# EAGLE design chaves (EAGLE 7.6.0)

## Sheet 1 of 2
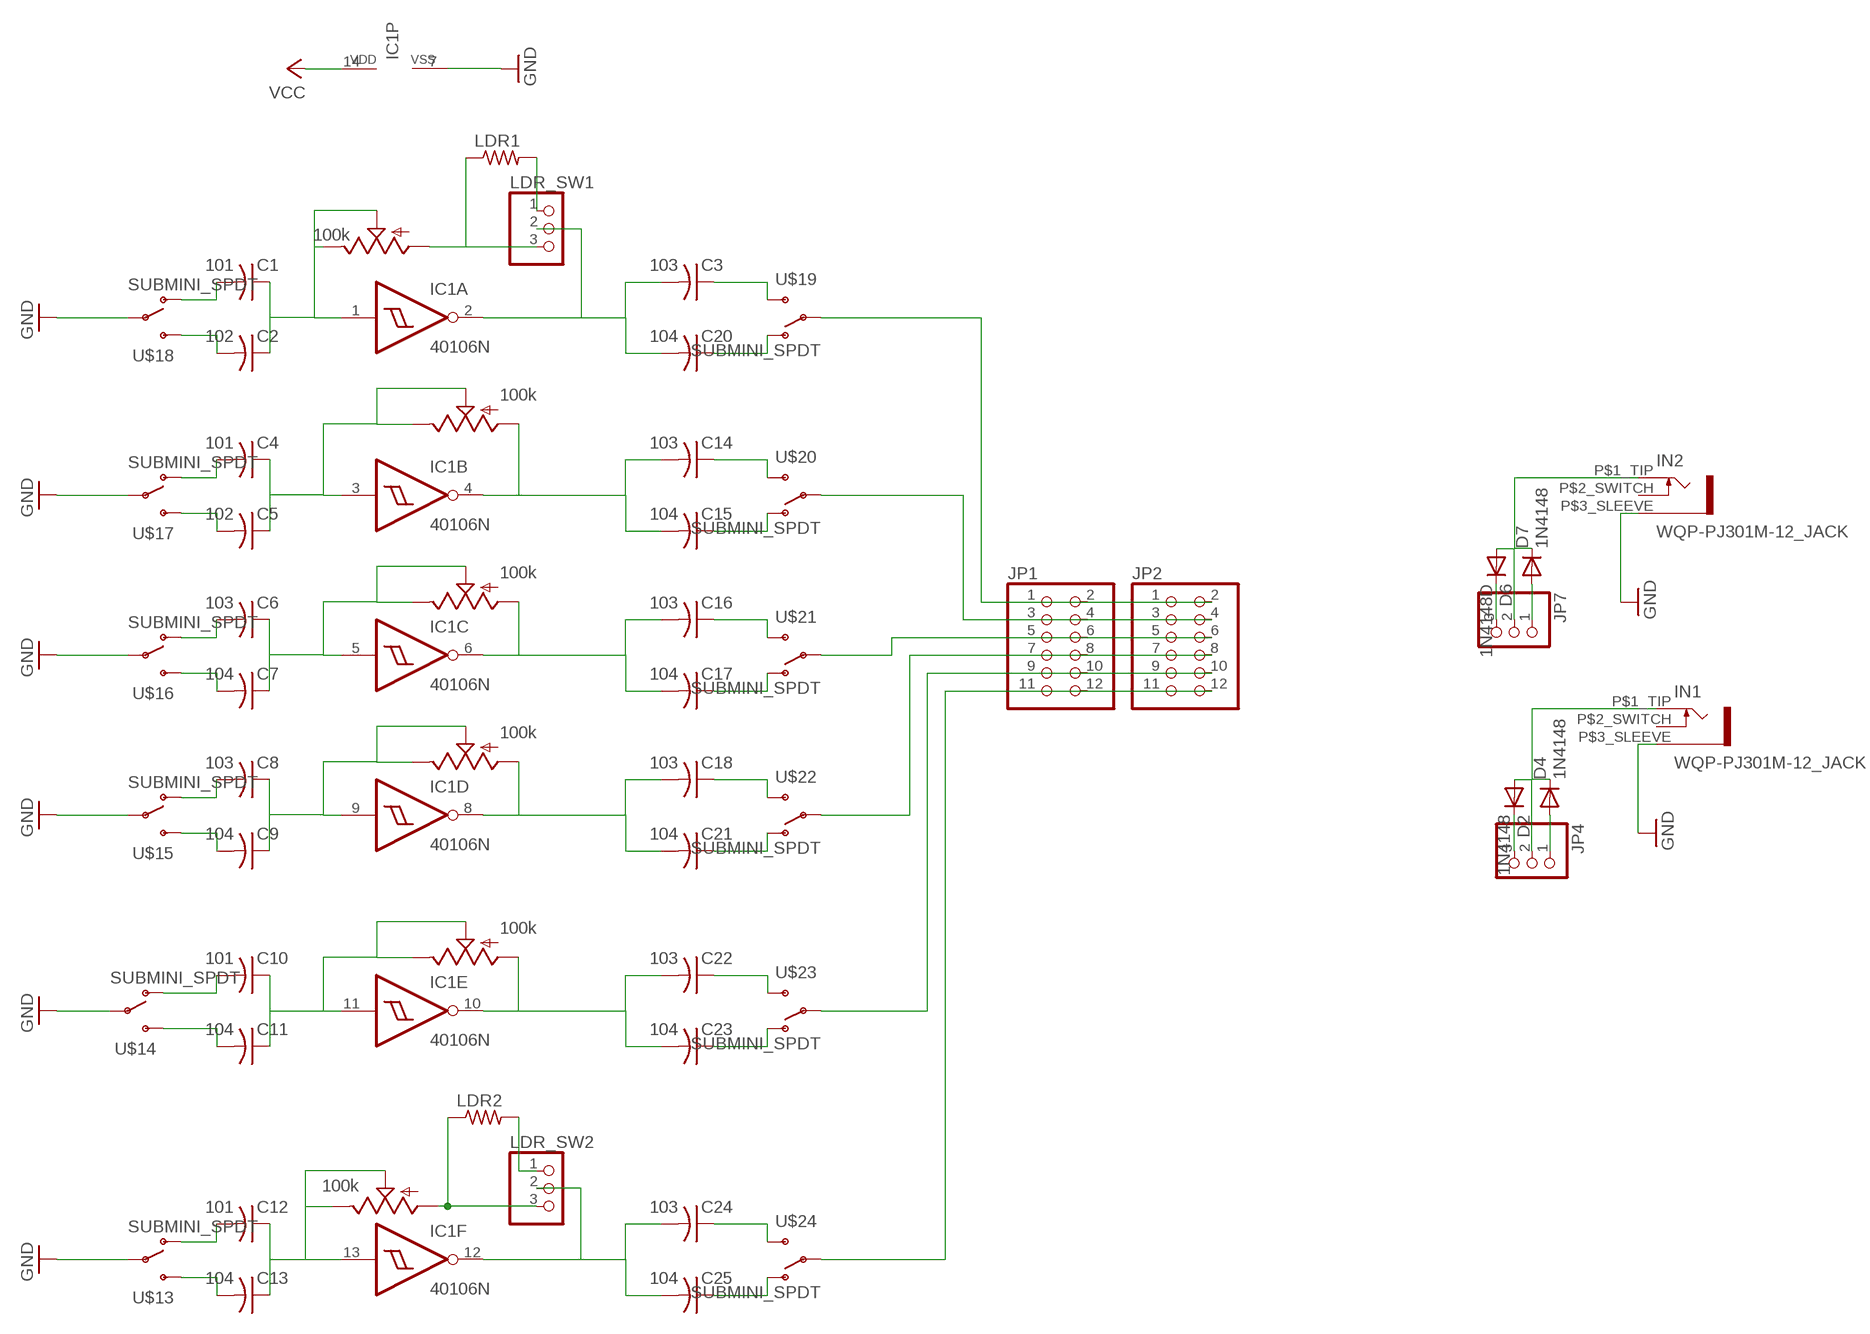
[diagram p0: schematic, sheet 1]

### Parts
C1  101  C-US050-025X075  [C050-025X075]
C2  102  C-US050-025X075  [C050-025X075]
C3  103  C-US050-025X075  [C050-025X075]
C4  101  C-US050-025X075  [C050-025X075]
C5  102  C-US050-025X075  [C050-025X075]
C6  103  C-US050-025X075  [C050-025X075]
C7  104  C-US050-025X075  [C050-025X075]
C8  103  C-US050-025X075  [C050-025X075]
C9  104  C-US050-025X075  [C050-025X075]
C10  101  C-US050-025X075  [C050-025X075]
C11  104  C-US050-025X075  [C050-025X075]
C12  101  C-US050-025X075  [C050-025X075]
C13  104  C-US050-025X075  [C050-025X075]
C14  103  C-US050-025X075  [C050-025X075]
C15  104  C-US050-025X075  [C050-025X075]
C16  103  C-US050-025X075  [C050-025X075]
C17  104  C-US050-025X075  [C050-025X075]
C18  103  C-US050-025X075  [C050-025X075]
C20  104  C-US050-025X075  [C050-025X075]
C21  104  C-US050-025X075  [C050-025X075]
C22  103  C-US050-025X075  [C050-025X075]
C23  104  C-US050-025X075  [C050-025X075]
C24  103  C-US050-025X075  [C050-025X075]
C25  104  C-US050-025X075  [C050-025X075]
D2  1N4148  1N4148DO35-7  [DO35-7]
D4  1N4148  1N4148DO35-7  [DO35-7]
D6  1N4148D  1N4148DO35-7  [DO35-7]
D7  1N4148  1N4148DO35-7  [DO35-7]
IC1  40106N  [DIL14]
IN1  WQP-PJ301M-12_JACK  [WQP-PJ301M-12_JACK]
IN2  WQP-PJ301M-12_JACK  [WQP-PJ301M-12_JACK]
JP1  PINHD-2X6  [2X06]
JP2  PINHD-2X6  [2X06]
JP4  PINHD-1X3CB  [1X03-CLEANBIG]
JP7  PINHD-1X3CB  [1X03-CLEANBIG]
LDR1  R-US_0204/7  [0204/7]
LDR2  R-US_0204/7  [0204/7]
LDR_SW1  PINHD-1X3  [1X03]
LDR_SW2  PINHD-1X3  [1X03]
POT1  100k  POT_USVERTICAL  [ALPS_POT_VERTICAL]
POT2  100k  POT_USVERTICAL  [ALPS_POT_VERTICAL]
POT3  100k  POT_USVERTICAL  [ALPS_POT_VERTICAL]
POT4  100k  POT_USVERTICAL  [ALPS_POT_VERTICAL]
POT5  100k  POT_USVERTICAL  [ALPS_POT_VERTICAL]
POT6  100k  POT_USVERTICAL  [ALPS_POT_VERTICAL]
U$13  SUBMINI_SPDT  [SUBMINI_TOGGLE]
U$14  SUBMINI_SPDT  [SUBMINI_TOGGLE]
U$15  SUBMINI_SPDT  [SUBMINI_TOGGLE]
U$16  SUBMINI_SPDT  [SUBMINI_TOGGLE]
U$17  SUBMINI_SPDT  [SUBMINI_TOGGLE]
U$18  SUBMINI_SPDT  [SUBMINI_TOGGLE]
U$19  SUBMINI_SPDT  [SUBMINI_TOGGLE]
U$20  SUBMINI_SPDT  [SUBMINI_TOGGLE]
U$21  SUBMINI_SPDT  [SUBMINI_TOGGLE]
U$22  SUBMINI_SPDT  [SUBMINI_TOGGLE]
U$23  SUBMINI_SPDT  [SUBMINI_TOGGLE]
U$24  SUBMINI_SPDT  [SUBMINI_TOGGLE]

### Nets
GND: IC1.7(P:VSS) IN1.P$3_SLEEVE IN2.P$3_SLEEVE U$13.COM(COMMON) U$14.COM(COMMON) U$15.COM(COMMON) U$16.COM(COMMON) U$17.COM(COMMON) U$18.COM(COMMON) ; also sheet 2
GND1: C3.2 C20.2 IC1.2(A:O) LDR_SW1.2
GND2: C14.2 C15.2 IC1.4(B:O) POT2.P$3(A)
GND3: C16.2 C17.2 IC1.6(C:O) POT3.P$3(A)
GND4: C18.2 C21.2 IC1.8(D:O) POT4.P$3(A)
GND5: C22.2 C23.2 IC1.10(E:O) POT5.P$3(A)
GND6: C24.2 C25.2 IC1.12(F:O) LDR_SW2.2
N$1: C1.2 U$18.1(O)
N$2: C2.2 U$18.3(S)
N$3: LDR2.2 LDR_SW2.1
N$4: C5.2 U$17.3(S)
N$5: C4.2 U$17.1(O)
N$6: LDR1.2 LDR_SW1.1
N$7: C8.2 U$15.1(O)
N$8: C9.2 U$15.3(S)
N$9: D6.A D7.C IN2.P$1_TIP JP7.2
N$10: C6.2 U$16.1(O)
N$11: C7.2 U$16.3(S)
N$16: C20.1 U$19.1(O)
N$17: C3.1 U$19.3(S)
N$18: JP1.1 JP1.2 JP2.1 JP2.2 U$19.COM(COMMON)
N$19: LDR1.1 LDR_SW1.3 POT1.P$3(A)
N$22: LDR2.1 LDR_SW2.3 POT6.P$3(A)
N$23: D2.A D4.C IN1.P$1_TIP JP4.2
N$24: C15.1 U$20.1(O)
N$26: C14.1 U$20.3(S)
N$27: JP1.3 JP1.4 JP2.3 JP2.4 U$20.COM(COMMON)
N$28: C17.1 U$21.1(O)
N$29: C16.1 U$21.3(S)
N$30: JP1.5 JP1.6 JP2.5 JP2.6 U$21.COM(COMMON)
N$31: C1.1 C2.1 IC1.1(A:I) POT1.P$1(E) POT1.P$2(S)
N$32: C4.1 C5.1 IC1.3(B:I) POT2.P$1(E) POT2.P$2(S)
N$33: C6.1 C7.1 IC1.5(C:I) POT3.P$1(E) POT3.P$2(S)
N$34: C8.1 C9.1 IC1.9(D:I) POT4.P$1(E) POT4.P$2(S)
N$37: C21.1 U$22.1(O)
N$38: C18.1 U$22.3(S)
N$39: JP1.7 JP1.8 JP2.7 JP2.8 U$22.COM(COMMON)
N$40: C23.1 U$23.1(O)
N$41: C22.1 U$23.3(S)
N$42: JP1.9 JP1.10 JP2.9 JP2.10 U$23.COM(COMMON)
N$43: C25.1 U$24.1(O)
N$44: C24.1 U$24.3(S)
N$45: JP1.11 JP1.12 JP2.11 JP2.12 U$24.COM(COMMON)
N$46: C10.2 U$14.1(O)
N$47: C10.1 C11.1 IC1.11(E:I) POT5.P$1(E) POT5.P$2(S)
N$48: C11.2 U$14.3(S)
N$49: C13.2 U$13.3(S)
N$50: C12.2 U$13.1(O)
N$51: C12.1 C13.1 IC1.13(F:I) POT6.P$1(E) POT6.P$2(S)
N$52: D2.C JP4.3
N$53: D4.A JP4.1
N$56: D6.C JP7.3
N$58: D7.A JP7.1
VCC: IC1.14(P:VDD) ; also sheet 2
Unconnected: IN1.P$2_SWITCH IN2.P$2_SWITCH

## Sheet 2 of 2
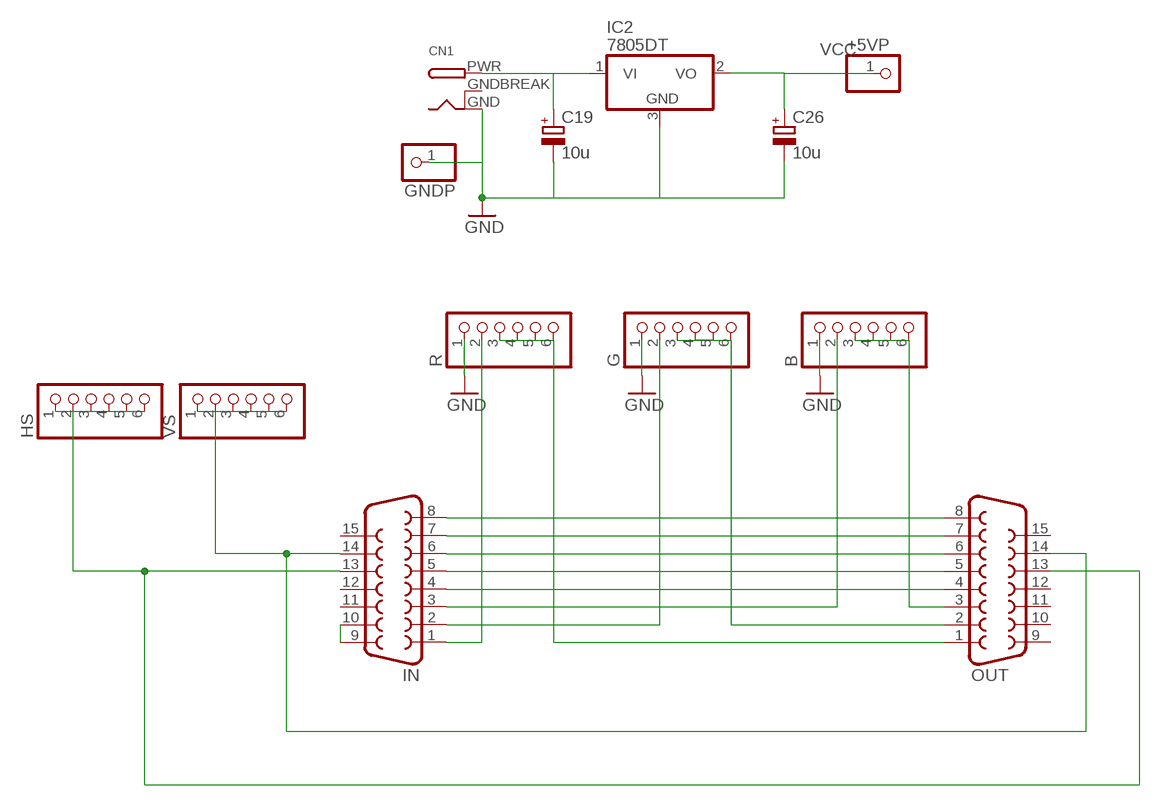
[diagram p1: schematic, sheet 2]

### Parts
+5VP  PINHD-1X1CB  [1X01-CLEANBIG]
B  PINHD-1X6CLEAN  [1X06-CLEAN]
C19  10u  CPOL-EUE2.5-5  [E2,5-5]
C26  10u  CPOL-EUE2.5-5  [E2,5-5]
CN1  DCBARRELPTH  [DCJACK_2MM_PTH]
G  PINHD-1X6CLEAN  [1X06-CLEAN]
GNDP  PINHD-1X1CB  [1X01-CLEANBIG]
HS  PINHD-1X6CLEAN  [1X06-CLEAN]
IC2  7805DT  [TO252]
IN  F15HDH  [HDF15H]
OUT  F15HDH  [HDF15H]
R  PINHD-1X6CLEAN  [1X06-CLEAN]
VS  PINHD-1X6CLEAN  [1X06-CLEAN]

### Nets
GND: B.1 C19.- C26.- CN1.GND G.1 GNDP.1 IC2.3(GND) IN.4 IN.5 IN.6 IN.7 IN.8 IN.9 IN.10 OUT.4 OUT.5 OUT.6 OUT.7 OUT.8 R.1 ; also sheet 1
N$12: IN.1 R.2
N$14: OUT.1 R.3 R.4 R.5 R.6
N$15: G.2 IN.2
N$21: G.3 G.4 G.5 G.6 OUT.2
N$25: B.2 IN.3
N$36: B.3 B.4 B.5 B.6 OUT.3
N$54: IN.14 OUT.14 VS.1 VS.2 VS.3 VS.4 VS.5 VS.6
N$55: HS.1 HS.2 HS.3 HS.4 HS.5 HS.6 IN.13 OUT.13
N$57: C19.+ CN1.PWR IC2.1(VI)
VCC: +5VP.1 C26.+ IC2.2(VO) ; also sheet 1
Unconnected: IN.11 IN.12 IN.15 OUT.9 OUT.10 OUT.11 OUT.12 OUT.15

## Power pins joined to a net without a drawn wire
GNDBREAK: CN1.GNDBREAK

## Library data of the parts
+5VP GNDP = adafruit:PINHD-1X1: Pin header 1x1 for 0.1" spacing With round pins
B G HS R VS = adafruit:PINHD-1X6: PIN HEADER
C1-C18 C20-C25 = adafruit:C-US: CAPACITOR, American symbol
C19 C26 = rcl:CPOL-EU: POLARIZED CAPACITOR, European symbol
CN1 = adafruit:DCBARREL: 2.0mm DC Barrel Jack DCJACK_2MM_PTH - Through Hole Jack (4UConnector: 05537)
D2 D4 D6 D7 = diode:1N4148: DIODE high speed (Philips)
IC1 = 40xx:40106: Hex SCHMITT TRIGGER
IC2 = adafruit:78*: Positive VOLTAGE REGULATOR Added bigger pads to the TO-92 package
IN OUT = adafruit:F15: SUB-D HDH is also known as a 'right angle VGA' connector
IN1 IN2 = MusicThingModular:WQP-PJ301M-12_JACK
JP1 JP2 = pinhead:PINHD-2X6: PIN HEADER
JP4 JP7 = adafruit:PINHD-1X3: PIN HEADER
LDR1 LDR2 = adafruit:R-US_: RESISTOR, American symbol
LDR_SW1 LDR_SW2 = pinhead:PINHD-1X3: PIN HEADER
POT1-POT6 = pot-alps:POT_US
U$13-U$24 = MusicThingModular:SUBMINI_SPDT

## Net classes
0 default: width 0.406 mm, drill 0.254 mm, clearance 0.254 mm

## Board
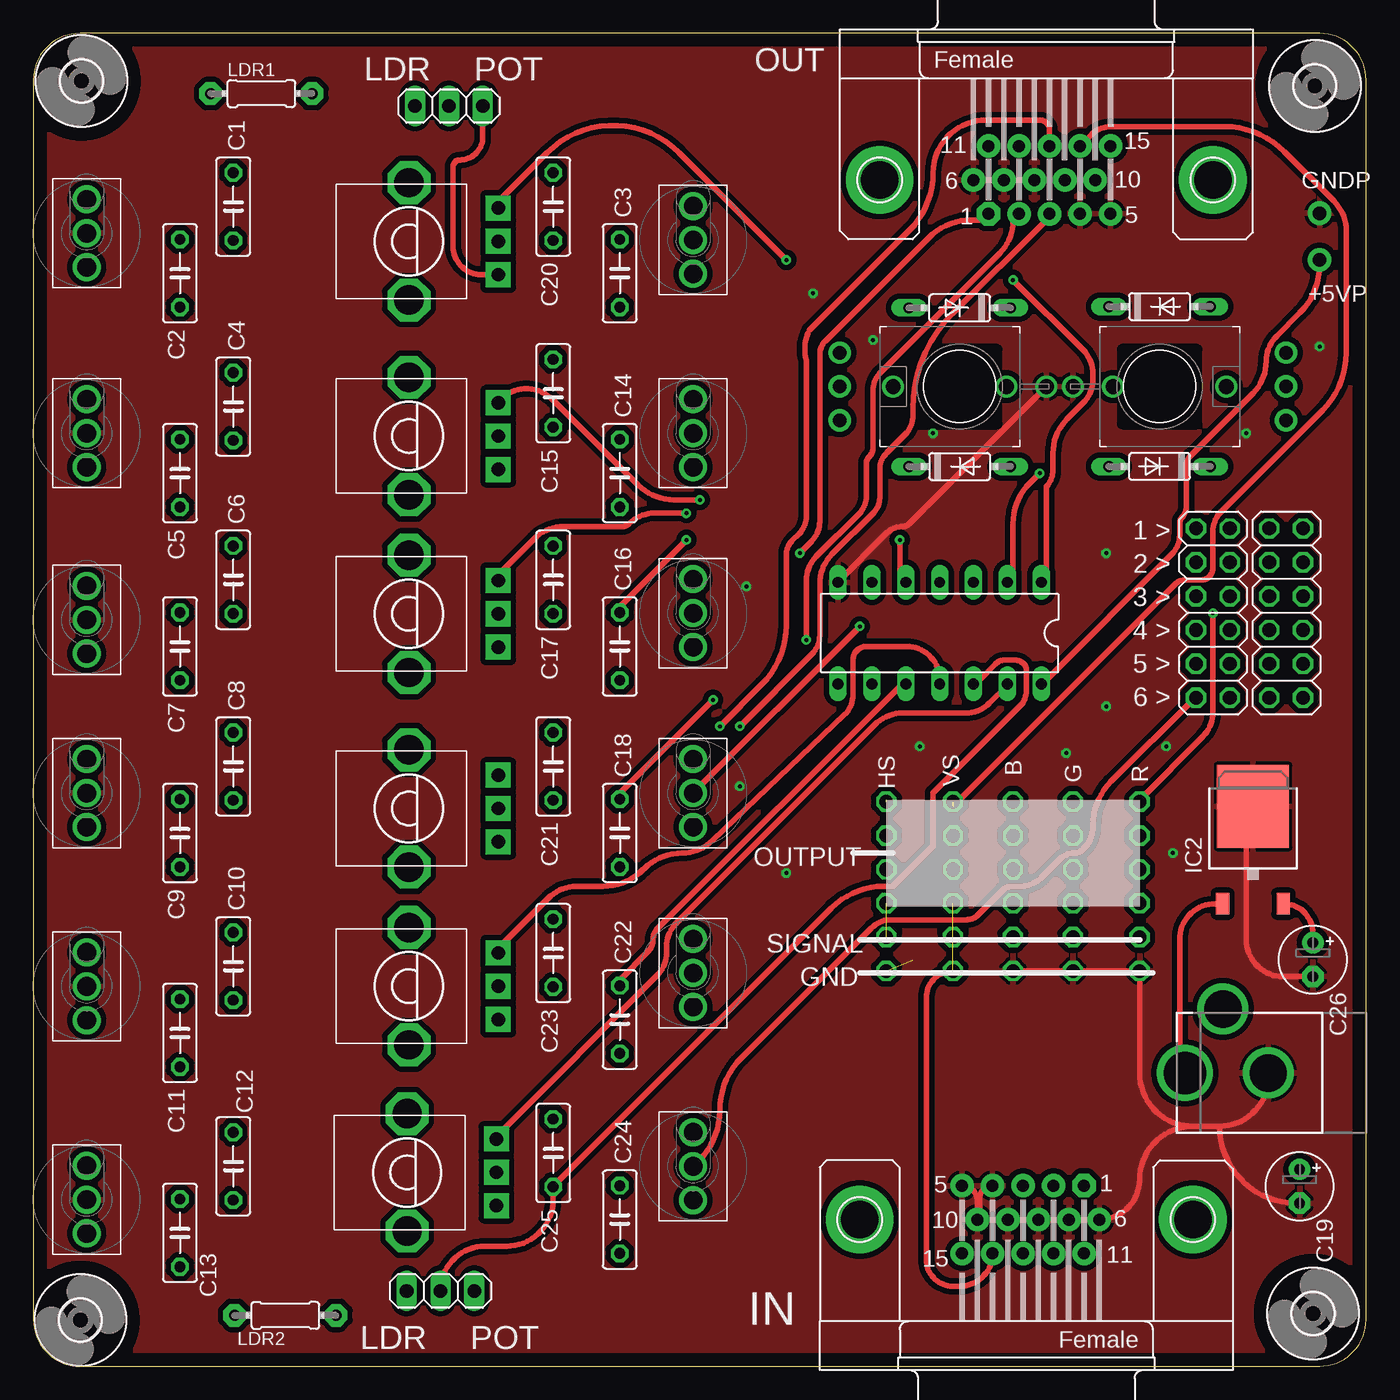
[diagram p2: board, top side]
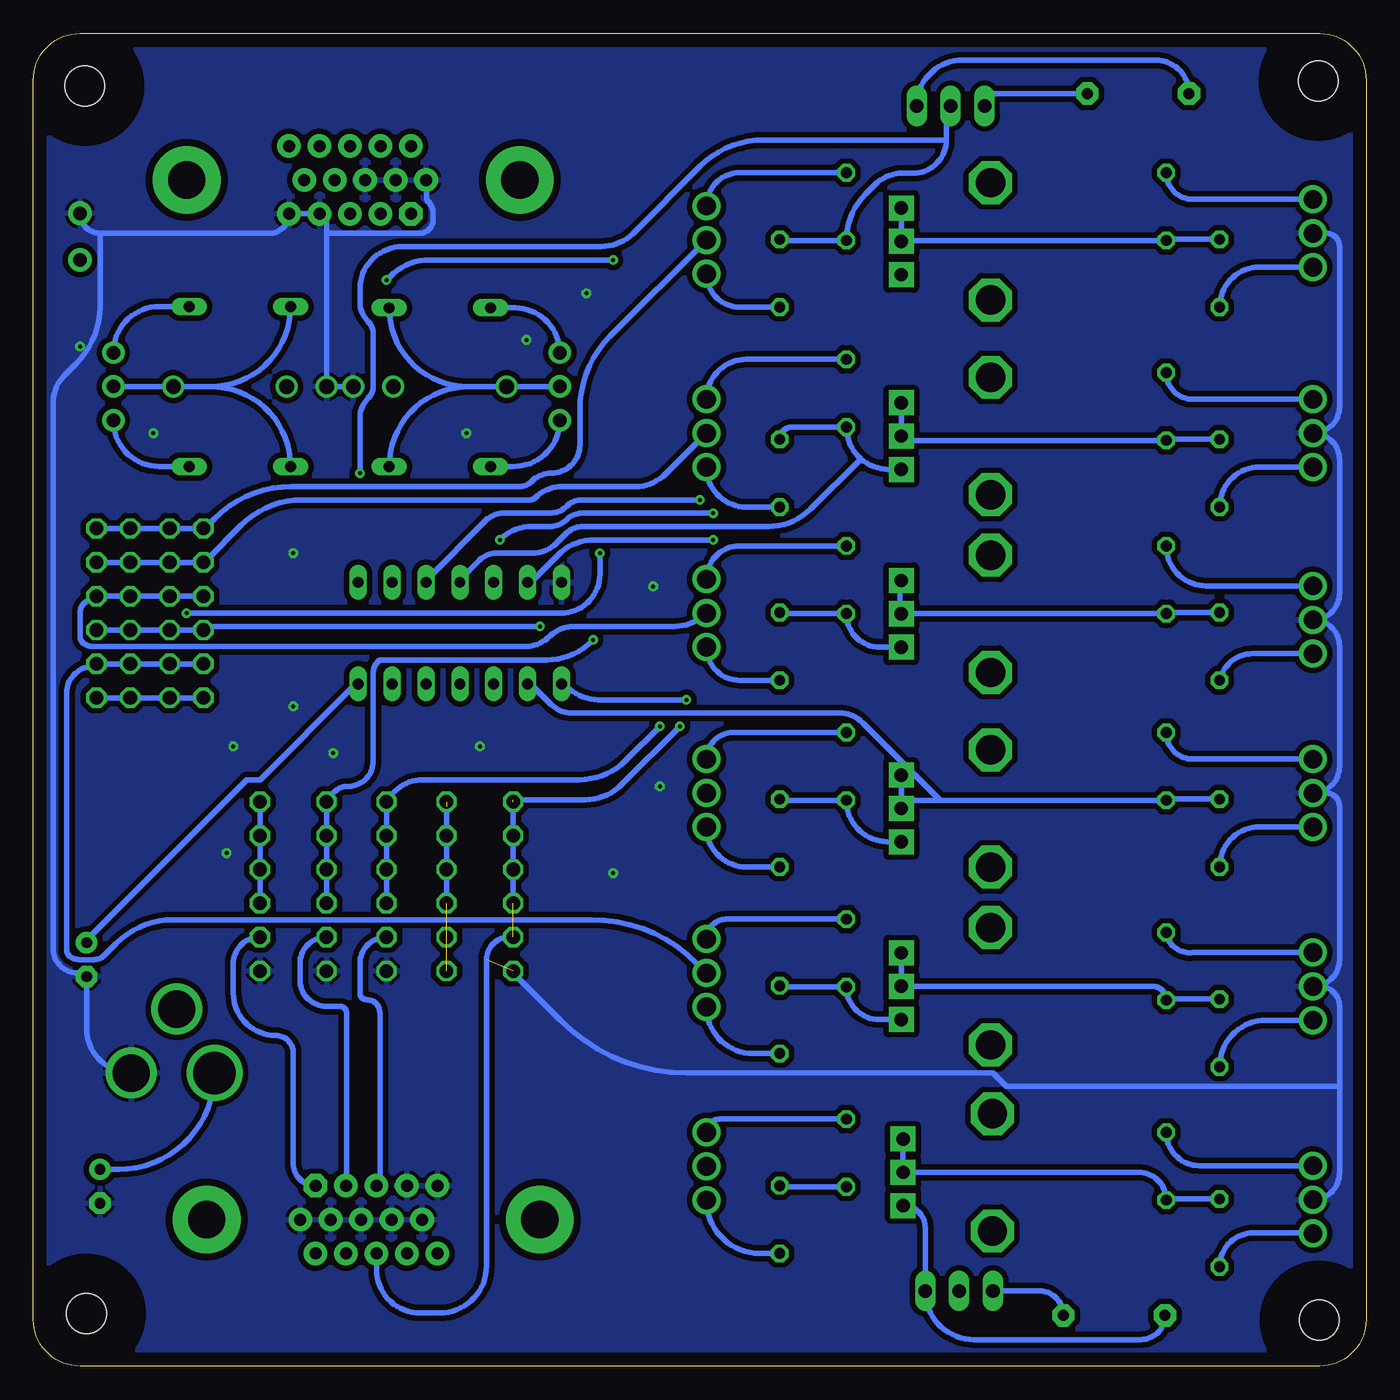
[diagram p3: board, bottom side, seen from below]

Size 100 x 100 mm. Coordinates in mm from the lower left corner, seen from the top.
Outline: 0,96.5 0,3.5 arc90 3.5,0 96.5,0 arc90 100,3.5 100,96.5 arc90 96.5,100 3.5,100 arc90 0,96.5
Copper layers (1*16): Top 0.035mm / dielectric 1.5mm / Bottom 0.035mm
Design rules "default *": minimum track width 10mil, minimum drill 24mil, track to track 8mil, track to pad 8mil, pad to pad 8mil, via to via 8mil, smd to smd 8mil, copper to edge 40mil, drill to drill 8mil, minimum pad ring 10mil, minimum via ring 8mil, stop-mask expansion 4mil, vias tented up to drill 0.33mm, thermal gap 10mil

### Footprints (pad centres in the part's own frame; a part is rotated, then mirrored left to right if it is on the bottom)
1X01-CLEANBIG = drill 1.016 pad 1.778: 1 0,0
1X06-CLEAN = drill 1.016 octagon: 1 -6.35,0; 2 -3.81,0; 3 -1.27,0; 4 1.27,0; 5 3.81,0; 6 6.35,0
C050-025X075 = drill 0.813 octagon: 1 -2.54,0; 2 2.54,0
E2,5-5 = drill 0.813 pad 1.6: + -1.27,0 | drill 0.813 pad 1.6 octagon: - 1.27,0
DCJACK_2MM_PTH = drill 2.8: GND 0,7.35; GNDBREAK 4.8,10.75 | drill 3.2: PWR 0,13.6
DO35-7 = drill 0.813 long: A 3.81,0; C -3.81,0
3,0 = hole 3: 0,0
DIL14 = drill 0.813 long: 1 -7.62,-3.81; 2 -5.08,-3.81; 3 -2.54,-3.81; 4 0,-3.81; 5 2.54,-3.81; 6 5.08,-3.81; 7 7.62,-3.81; 8 7.62,3.81; 9 5.08,3.81; 10 2.54,3.81; 11 0,3.81; 12 -2.54,3.81; 13 -5.08,3.81; 14 -7.62,3.81
TO252 = smd 1 x 1.6: 1 -2.28,-4.8; 2 2.28,-4.8 | smd 5.4 x 6.2: 3 0,2.5
HDF15H = drill 0.9 pad 1.778 octagon: 1 4.329,2.54 | drill 0.9 pad 1.778: 2 2.043,2.54; 3 -0.243,2.54; 4 -2.529,2.54; 5 -4.815,2.54; 6 5.472,0; 7 3.186,0; 8 0.9,0; 9 -1.386,0; 10 -3.672,0; 11 4.329,-2.54; 12 2.043,-2.54; 13 -0.243,-2.54; 14 -2.529,-2.54; 15 -4.815,-2.54 | drill 2.8 pad 5.08: P$1 -12.5,0; P$2 12.5,0
WQP-PJ301M-12_JACK = drill 1.1: P$1_TIP 0,5; P$2_SWITCH 0,-3.5; P$3_SLEEVE 0,-6.5
2X06 = drill 1.016 octagon: 1 -6.35,-1.27; 2 -6.35,1.27; 3 -3.81,-1.27; 4 -3.81,1.27; 5 -1.27,-1.27; 6 -1.27,1.27; 7 1.27,-1.27; 8 1.27,1.27; 9 3.81,-1.27; 10 3.81,1.27; 11 6.35,-1.27; 12 6.35,1.27
1X03-CLEANBIG = drill 1.016 pad 1.676: 1 -2.54,0; 2 0,0; 3 2.54,0
0204/7 = drill 0.813 pad 1.676 octagon: 1 -3.81,0; 2 3.81,0
1X03 = drill 1.016 long: 1 -2.54,0; 2 0,0; 3 2.54,0
ALPS_POT_VERTICAL = drill 1 pad 1.88 square: P$1 -2.5,6.7; P$2 0,6.7; P$3 2.5,6.7 | drill 2.2 pad 3.175 octagon: P$4 -4.4,0; P$5 4.4,0
SUBMINI_TOGGLE = drill 1.4 pad 1.829: 1 -2.54,0; 3 2.54,0; COM 0,0

### Placement (x,y rotation side)
+5VP  96.5,83 0 top
B  73.5,36 90 top
C1  15,87 90 top
C2  11,82 270 top
C3  44,82 90 top
C4  15,72 90 top
C5  11,67 270 top
C6  15,59 90 top
C7  11,54 270 top
C8  15,45 90 top
C9  11,40 270 top
C10  15,30 90 top
C11  11,25 270 top
C12  15,15 90 top
C13  11,10 270 top
C14  44,67 90 top
C15  39,73 270 top
C16  44,54 90 top
C17  39,59 270 top
C18  44,40 90 top
C19  95,13.5 270 top
C20  39,87 270 top
C21  39,45 270 top
C22  44,26 90 top
C23  39,31 270 top
C24  44,11 90 top
C25  39,16 270 top
C26  96,30.5 270 top
CN1  100,22 90 top
D2  84.5,67.5 180 top
D4  84.5,79.5 0 top
D6  69.5,67.5 0 top
D7  69.5,79.4 180 top
E$1  [3,0]  96.02,3.95 0 top
E$5  [3,0]  3.52,3.45 0 top
E$7  [3,0]  3.6,96.42 0 top
E$8  [3,0]  96.15,96.06 0 top
G  78,36 90 top
GNDP  96.5,86.5 0 top
HS  64,36 90 top
IC1  68,55 180 top
IC2  91.5,39.5 0 top
IN  74.5,11 0 top
IN1  84.5,73.5 270 top
IN2  69.5,73.5 90 top
JP1  88.5,56.5 270 top
JP2  94,56.5 270 top
JP4  94,73.5 270 top
JP7  60.5,73.5 270 top
LDR1  17.11,95.48 0 top
LDR2  18.91,3.81 0 top
LDR_SW1  31.18,94.55 0 top
LDR_SW2  30.55,5.65 0 top
OUT  76,89 180 top
POT1  28.18,84.39 270 top
POT2  28.18,69.78 270 top
POT3  28.18,56.45 270 top
POT4  28.18,41.84 270 top
POT5  28.18,28.51 270 top
POT6  28.05,14.54 270 top
R  83,36 90 top
U$13  4,12.5 270 top
U$14  4,28.5 270 top
U$15  4,43 270 top
U$16  4,56 270 top
U$17  4,70 270 top
U$18  4,85 270 top
U$19  49.5,84.5 270 top
U$20  49.5,70 270 top
U$21  49.5,56.5 270 top
U$22  49.5,43 270 top
U$23  49.5,29.5 270 top
U$24  49.5,15 270 top
VS  69,36 90 top

### Tracks (layer width: path | path; a pad name or v marks a point on that pad's centre or on a via)
GND  (via drill 0.3)
  Top 0.406: CN1.GND 92.65,21.65 arc-90 89,18 | 89,18 87,18 | 87,18 arc-90 83,22 R.1 G.1 B.1 | IN.5 arc-90 70.83,12.4 IN.10 71,11 | 71,11 71,12.57 arc-90 IN.4 | 71,11 IN.9 IN.8 IN.7 IN.6 80,11 arc90 83,14 arc-90 87,18 | C19.- 94.77,12.23 arc-90 89,18 | C26.- 93.77,29.23 arc-90 91,32 91,41 arc-90 92,42 IC2.3 | OUT.6 OUT.7 OUT.8 | IN2.P$3_SLEEVE 65.68,63.18 arc-45 65.25,63 arc45 63.97,62.47 60.5,59 IC1.7
  Bottom 0.406: U$13.COM arc-90 2,14.5 2,21 | 2,21 2,27 arc-90 3.5,28.5 U$14.COM arc-90 2,30.5 2,42 arc-90 3,43 U$15.COM arc-90 2,45 2,54 arc-90 U$16.COM arc-90 2,58 2,68 arc-90 U$17.COM arc-90 2,72 2,84 arc-90 3,85 U$18.COM | CN1.GND arc90 96,25.35 C26.- 96,29.5 96.7,29.5 arc90 98.5,31.3 98.5,72.33 arc45 97.67,74.33 96.77,75.23 arc-45 95,79.5 95,85 | IN2.P$3_SLEEVE IN1.P$3_SLEEVE 78,85 | 78,85 78,85.93 arc-90 OUT.4 OUT.5 arc90 82.28,85 95,85 | 95,85 arc90 GNDP.1 | 78,85 71,85 arc-90 70,86 70,86.5 arc-45 70.35,87.35 arc45 70.5,87.71 70.5,89 OUT.6 | 2,21 27,21 28,22 50.94,22 arc45 60.44,25.93 64,29.5
  other vias: 56.5,37 53,43.5 58.5,80.5 66.5,46.5 85,46.5 63,77 91,70 80.5,49.5 96.5,76.5 53.5,58.5 80.5,61 77.5,46 85.5,38.5 67.5,70
  pour Top (isolate 0.406): 0,100 100,100 100,0 0,0
  pour Bottom (isolate 0.406): 0,100 100,100 100,0 0,0
GND1  (via drill 0.3)
  Top 0.406: v75.5,67 74.75,66.25 arc45 73.5,63.23 73.5,59 IC1.2
  Bottom 0.406: C3.2 arc-90 43.92,84.46 C20.2 arc45 37.56,87.94 36.85,88.65 arc45 34.79,89.5 34,89.5 arc-90 31.5,92 | LDR_SW1.2 arc-90 31.5,94.23 31.5,92 | v75.5,67 75.5,71.12 arc45 74.88,72.62 arc-45 74.5,73.54 74.5,77.46 arc-45 74.88,78.38 arc45 75.5,79.88 75.5,80.8 arc90 72.3,84 57.39,84 arc-45 55.02,84.98 49.97,90.03 arc45 45.21,92 31.5,92
GND2
  Bottom 0.406: C14.2 arc90 43.08,70.46 C15.2 arc-49 37.93,68.08 | POT2.P$3 35.83,67.28 arc41 37.93,68.08 | IC1.4 68,59 66.53,60.47 arc45 65.25,61 62.54,61 arc-45 60.77,61.73 60.03,62.47 arc45 58.75,63 44.85,63 arc-45 41.69,64.31 38,68 37.93,68.08
GND3  (via drill 0.3)
  Top 0.406: v49,62 44,57 C16.2
  Bottom 0.406: POT3.P$3 36.49,53.95 arc90 C17.2 43.92,56.46 arc90 C16.2 | v49,62 57.88,62 arc-45 60.64,60.86 62.5,59 IC1.6
GND4  (via drill 0.3)
  Top 0.406: v51,50 44,43 C18.2
  Bottom 0.406: POT4.P$3 35.88,39.34 arc90 C21.2 43.92,42.46 arc90 C18.2 | v51,50 57.59,50 arc45 60,51 IC1.8
GND5
  Top 0.406: IC1.10 65,51 46.83,32.83 arc45 46.5,32.04 arc-45 46.12,31.12 44,29 C22.2
  Bottom 0.406: POT5.P$3 36.55,26.01 arc90 C23.2 43.92,28.46 arc90 C22.2
GND6
  Top 0.406: LDR_SW2.2 arc-90 33.9,9 35.5,9 arc90 39,12.5 C25.2 39,13.5 59.88,34.38 arc-45 63.79,36 64.5,36 67.5,39 67.5,43 74.06,49.56 arc45 74.5,50.62 74.5,52.26 arc45 74.33,52.67 arc45 73.54,53 72.96,53 arc45 72.17,52.67 71,51.5 IC1.12
  Bottom 0.406: C25.2 43.92,13.46 arc90 C24.2
N$1
  Bottom 0.406: U$18.1 13,87.54 arc90 C1.2
N$2
  Bottom 0.406: U$18.3 8,82.46 arc-90 C2.2
N$3
  Bottom 0.406: LDR2.2 arc-90 24.55,5.65 LDR_SW2.1
N$4
  Bottom 0.406: U$17.3 8,67.46 arc-90 C5.2
N$5
  Bottom 0.406: U$17.1 13,72.54 arc90 C4.2
N$6
  Bottom 0.406: LDR1.2 27.71,95.48 arc-90 LDR_SW1.1
N$7
  Bottom 0.406: U$15.1 13,45.54 arc90 C8.2
N$8
  Bottom 0.406: U$15.3 8,40.46 arc-90 C9.2
N$9
  Bottom 0.406: JP7.2 IN2.P$1_TIP 67.31,73.5 | 67.31,73.5 67.41,73.5 arc90 D7.C | D6.A arc90 67.31,73.5
N$10
  Bottom 0.406: U$16.1 12,58.54 arc90 C6.2
N$11
  Bottom 0.406: U$16.3 8.54,53.46 arc-90 11,51 C7.2
N$12
  Bottom 0.406: R.2 arc-90 85,30.19 85,28 arc-90 81.81,24.81 arc90 80.5,23.5 80.5,15.21 arc-90 IN.1
N$14  (via drill 0.3)
  Top 0.406: v57.5,61 58.38,61.88 arc45 59,63.38 59,75.91 arc-45 59.41,76.91 67.15,84.65 arc-45 70.41,86 71.5,86 OUT.1 | v88.5,56.5 88.5,49.06 arc-45 87.75,47.25 83,42.5 R.6
  Bottom 0.406: R.6 R.5 | R.5 83,39 | R.5 R.4 R.3 | v88.5,56.5 60.41,56.5 arc-90 57.5,59.41 v57.5,61
N$15
  Bottom 0.406: G.2 arc-90 80,30.19 80,29 arc-90 78,27 77,27 arc90 76.5,26.5 76.5,13.58 arc90 IN.2
N$16
  Bottom 0.406: C20.1 47,89.54 arc-90 U$19.1
N$17
  Bottom 0.406: C3.1 47,79.46 arc90 U$19.3
N$18
  Bottom 0.406: JP2.2 JP2.1 JP1.2 JP1.1 87,63 86.4,63.6 arc45 80.6,66 63.54,66 arc-45 62.62,66.38 arc45 61.12,67 arc-90 59,69.12 59,71.78 arc45 56.72,77.28 U$19.COM
N$19
  Top 0.406: LDR_SW1.3 33.72,92.22 arc-90 32,90.5 arc90 31.5,90 31.5,84 arc90 33.61,81.89 POT1.P$3
  Bottom 0.406: LDR1.1 arc-90 15.81,98 30.27,98 arc-90 LDR_SW1.3
N$21  (via drill 0.3)
  Top 0.406: v58,54.5 58,58.96 arc-45 58.73,60.73 61.97,63.97 arc45 62.5,65.25 62.5,67.71 arc-45 62.71,68.21 arc45 63,68.91 63,73.17 arc-45 63.59,74.59 72.52,83.52 arc45 73.5,85.89 73.5,86 OUT.2
  Bottom 0.406: G.3 G.4 G.5 G.6 78,42.5 77.41,43.09 arc45 76.41,43.5 arc-90 74.5,45.41 74.5,52 arc45 74.15,52.85 arc45 73.79,53 61.45,53 arc-45 58.12,54.38 v58,54.5
N$22
  Bottom 0.406: LDR2.1 arc90 16.91,2 29.43,2 arc90 LDR_SW2.3 33.09,10.38 arc-90 POT6.P$3
N$23
  Bottom 0.406: JP4.2 IN1.P$1_TIP 86.69,73.5 | D2.A arc-90 86.69,73.5 | D4.C arc90 86.69,73.5
N$24
  Bottom 0.406: C15.1 46.5,75.54 arc-90 U$20.1
N$25
  Bottom 0.406: B.2 arc-90 75.5,30.19 75.5,28 arc-90 75,27.5 arc90 74,26.5 74,13.8 arc90 IN.3
N$26
  Bottom 0.406: C14.1 46.5,64.46 arc90 U$20.3
N$27
  Bottom 0.406: JP2.4 JP2.3 JP1.4 JP1.3 87,60.5 84.41,63.09 arc45 79.8,65 62.71,65 arc-45 62.35,65.15 arc45 60.29,66 54.83,66 arc-45 52.56,66.94 U$20.COM
N$28
  Bottom 0.406: C17.1 47,61.54 arc-90 U$21.1
N$29
  Bottom 0.406: C16.1 47,51.46 arc90 U$21.3
N$30
  Bottom 0.406: JP1.5 JP1.6 JP2.5 JP2.6 95.5,57.5 arc-90 96.5,56.5 96.5,54.79 arc-45 96.29,54.29 arc-45 95.59,54 63.09,54 arc-45 61.23,54.77 arc45 59.46,55.5 51.91,55.5 arc-45 U$21.COM
N$31  (via drill 0.3)
  Top 0.406: v73.5,81.5 78.77,76.23 arc-45 79.5,74.46 79.5,74.06 arc-45 78.75,72.25 77.56,71.06 arc45 76.5,68.51 76.5,67.21 arc-45 76,66 76,59 IC1.1 | v56.5,83 48.46,91.04 arc90 38.54,91.04 34.5,87 POT1.P$1
  Bottom 0.406: C2.1 14.92,84.54 arc-90 C1.1 34.81,84.46 arc-90 POT1.P$2 POT1.P$1 | v56.5,83 70.24,83 arc-45 73.24,81.76 v73.5,81.5
N$32  (via drill 0.3)
  Top 0.406: v50,65 48.08,65 arc-45 45.38,66.11 39,72.5 arc90 35,72.5 POT2.P$1
  Bottom 0.406: C5.1 14.92,69.54 arc-90 C4.1 34.55,69.46 arc90 POT2.P$2 POT2.P$1 | v50,65 58.83,65 arc-45 59.97,64.53 arc45 61.25,64 64.75,64 arc-45 66.03,63.47 70.5,59 IC1.3
N$33  (via drill 0.3)
  Top 0.406: v65,62 65,59 IC1.5 | v49,64 46.62,64 arc45 44.71,63.21 arc-45 44.2,63 39.83,63 arc45 37.56,62.06 34.5,59 POT3.P$1
  Bottom 0.406: C7.1 14.46,56.54 arc-90 15,56 C6.1 POT3.P$2 arc-90 POT3.P$2 34.88,56.12 arc90 35,56 35,58.83 arc90 POT3.P$1 | v65,62 arc45 62.59,63 61.25,63 arc-45 59.97,63.53 arc45 58.83,64 v49,64
N$34
  Bottom 0.406: C9.1 14.92,42.54 arc-90 C8.1 32,42.46 | 32,42.46 34.27,42.46 arc-90 POT4.P$2 POT4.P$1 | IC1.9 62.5,51 61.16,49.66 arc-45 59.57,49 39.54,49 arc45 37.77,48.27 32,42.5 32,42.46
N$36  (via drill 0.3)
  Top 0.406: v53,48 58.41,53.41 arc45 59,54.83 59,58.69 arc-45 59.93,60.93 63.06,64.06 arc45 63.5,65.12 63.5,67.25 arc-45 64.03,68.53 65.41,69.91 arc45 66,71.33 66,71.81 arc-45 68.97,78.97 76,86 OUT.3
  Bottom 0.406: B.3 B.4 B.5 B.6 73.5,42.5 72.85,43.15 arc45 70.79,44 59.05,44 arc-45 55.55,45.45 v53,48
N$37
  Bottom 0.406: C21.1 47.5,47.54 arc-90 U$22.1
N$38
  Bottom 0.406: C18.1 46.5,37.46 arc90 U$22.3
N$39  (via drill 0.3)
  Top 0.406: v62,55.5 U$22.COM
  Bottom 0.406: JP2.8 JP2.7 JP1.8 JP1.7 87,55.5 v62,55.5
N$40
  Bottom 0.406: C23.1 48,33.54 arc-90 U$23.1
N$41
  Bottom 0.406: C22.1 46,23.46 arc90 U$23.3
N$42
  Bottom 0.406: JP1.9 JP1.10 JP2.9 JP2.10 95.5,52.5 arc-90 97.5,50.5 97.5,31.24 arc-45 97.33,30.83 arc-45 96.54,30.5 95.46,30.5 arc-45 94.67,30.83 93.77,31.73 arc45 89.5,33.5 58.13,33.5 arc45 50.23,30.23 U$23.COM
N$43
  Bottom 0.406: C25.1 48.5,18.54 arc-90 U$24.1
N$44
  Bottom 0.406: C24.1 45.5,8.46 arc90 U$24.3
N$45
  Top 0.406: U$24.COM 49.95,15.46 arc45 51.5,19.18 arc-45 53.14,23.14 62.88,32.88 arc-45 64.38,33.5 70.04,33.5 arc45 70.83,33.83 72.71,35.71 arc-45 73.41,36 73.94,36 arc45 75.75,36.75 77.09,38.09 arc-45 78.09,38.5 arc45 78.79,38.79 arc45 79.5,40.5 79.5,40.59 arc-45 80.85,43.85 87,50 JP1.11
  Bottom 0.406: JP2.12 JP2.11 JP1.12 JP1.11
N$46
  Bottom 0.406: U$14.1 13,31.04 arc90 C10.2
N$47
  Top 0.406: POT5.P$1 35,31.5 38.61,35.11 arc-45 40.76,36 42.72,36 arc45 45.76,37.26 45.82,37.32 arc-45 48.67,38.5 arc45 50.94,39.44 60.86,48.89 arc46 61.5,50.38 61.5,53 arc-90 62.5,54 65.5,54 arc-90 68,51.5 IC1.11
  Bottom 0.406: C11.1 14.92,27.54 arc-90 C10.1 arc-90 16.05,28.51 POT5.P$2 | 34.37,28 arc90 POT5.P$2 | POT5.P$2 POT5.P$1
N$48
  Bottom 0.406: U$14.3 7.5,25.96 arc-90 C11.2
N$49
  Bottom 0.406: U$13.3 4,10 8.46,10 arc-90 C13.2
N$50
  Bottom 0.406: U$13.1 12.5,15.04 arc90 C12.2
N$51
  Top 0.406: IC1.13 73,51 71.75,49.75 arc-45 69.94,49 65.26,49 arc45 63.11,48.11 48.23,33.23 arc45 47.5,31.46 47.5,31.04 arc-45 46.77,29.27 35,17.5 POT6.P$1
  Bottom 0.406: C13.1 14.92,12.54 arc-90 C12.1 arc-90 17.08,14.54 POT6.P$2 POT6.P$1
N$52
  Bottom 0.406: D2.C 90.54,67.5 arc90 JP4.3
N$53
  Bottom 0.406: D4.A 90.54,79.5 arc-90 JP4.1
N$54  (3 unrouted)
  Top 0.406: 69,42 85.67,58.67 arc-45 86.46,59 87.71,59 arc45 88.21,59.21 arc45 88.5,59.91 88.5,62.62 arc-45 89.12,64.12 96.74,71.74 arc45 98.5,75.99 98.5,85.17 arc45 97.56,87.44 93.86,91.14 arc45 89.36,93 80.83,93 arc45 79.41,92.41 79,92 OUT.14 | IN.14 arc-90 69.51,6 69,6 arc-90 67,8 67,27.65 arc-90 VS.1
  Bottom 0.406: VS.3 VS.4 VS.5 VS.6
N$55  (via drill 0.3)  (3 unrouted)
  Top 0.406: v51.5,48 54.66,51.16 arc45 56.5,55.59 56.5,60.84 arc-45 56.96,61.96 57.47,62.47 arc45 58,63.75 58,75.44 arc-45 58.25,77.75 65.73,85.23 arc45 67.5,89.5 arc-90 71.5,93.5 75.5,93.5 arc-90 76.24,92.76 OUT.13
  Bottom 0.406: 64,42.5 58.62,42.5 arc-45 55.86,43.64 v51.5,48 | HS.2 64.31,32.19 arc-90 66,30.5 66,7.5 arc90 69.5,4 71,4 arc90 74.26,7.26 IN.13 | HS.3 HS.4 HS.5 HS.6
N$56
  Bottom 0.406: JP7.3 arc90 63.96,67.5 D6.C
N$57
  Top 0.406: IC2.1 88.7,34.7 arc90 86,32 86,22.4 arc90 CN1.PWR
  Bottom 0.406: C19.+ 93.63,14.77 arc-90 CN1.PWR
N$58
  Bottom 0.406: JP7.1 arc-90 63.86,79.4 D7.A
VCC
  Top 0.406: C26.+ 96,32.48 arc90 IC2.2 | +5VP.1 96.5,82.58 arc-45 95.03,79.03 93.28,77.28 arc45 92.5,75.39 arc-45 91.52,73.02 86.83,68.33 arc45 86.5,67.54 86.5,64.41 arc-45 86.21,63.71 arc45 86,63.21 86,62.33 arc-45 85.41,60.91 76,51.5 IC1.14
  Bottom 0.406: IC1.14 76,51 83,44 84,44 96,32 C26.+

### Text on the board
tNames: LDR | POT | 1 > | 2 > | 3 > | 4 > | 5 > | 6 > | OUTPUT | SIGNAL | GND | LDR | POT
bValues: CHA/VES - based on jonasbers.com/chav/ | http://github.com/ttreintaysiete/chaves